# EAGLE design powerboard 3.3V, 5V_v1 (EAGLE 7.5.0)
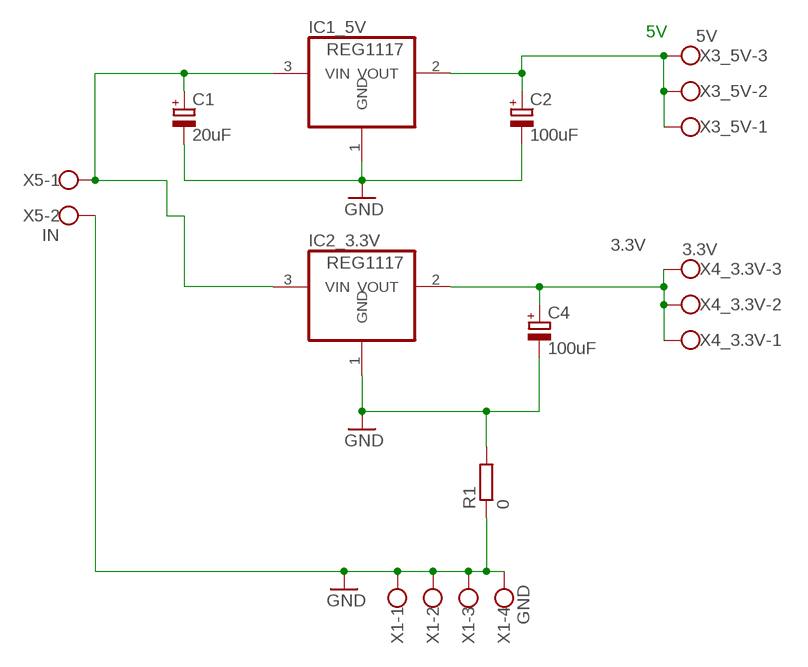
[diagram p0: schematic, sheet 1]

## Parts
C1  20uF  CPOL-EUE3.5-8  [E3,5-8]
C2  100uF  CPOL-EUE3.5-8  [E3,5-8]
C4  100uF  CPOL-EUE3.5-8  [E3,5-8]
IC1_5V  REG1117  [SOT223]
IC2_3.3V  REG1117  [SOT223]
R1  0  R-EU_0204/5  [0204/5]
X1  GND  W237-4  [W237-4]
X3_5V  5V  W237-103  [W237-103]
X4_3.3V  3.3V  W237-103  [W237-103]
X5  IN  W237-102  [W237-102]

## Nets
3.3V [power]: C4.+ IC2_3.3V.2(VOUT) X4_3.3V.1 X4_3.3V.2 X4_3.3V.3
5V [power]: C2.+ IC1_5V.2(VOUT) X3_5V.1 X3_5V.2 X3_5V.3
GND [power]: C1.- C2.- C4.- IC1_5V.1(GND) IC2_3.3V.1(GND) R1.1 R1.2 X1.1 X1.2 X1.3 X1.4 X5.2
VIN [power]: C1.+ IC1_5V.3(VIN) IC2_3.3V.3(VIN) X5.1

## Library data of the parts
C1 C2 C4 = resistor:CPOL-EU: POLARIZED CAPACITOR, European symbol
IC1_5V IC2_3.3V = burr-brown:REG1117: 800mA and 1A Low Dropout (LDO) Positive Regulator 1.8V, 2.5V, 2.85V, 3.3V, 5V, and Adj; MPN: REG1117; OC_FARNELL: 1097566; OC_NEWARK: 14P6981
R1 = resistor:R-EU_: RESISTOR, European symbol
X1 = con-wago-500:W237-4: WAGO SCREW CLAMP; OC_FARNELL: unknown; OC_NEWARK: unknown
X3_5V X4_3.3V = con-wago-500:W237-103: WAGO SCREW CLAMP; MPN: 237-103; OC_FARNELL: unknown; OC_NEWARK: 18M7116
X5 = con-wago-500:W237-102: WAGO SCREW CLAMP; MPN: 237-102; OC_FARNELL: unknown; OC_NEWARK: 70K9898

## Net classes
1 power: width 1 mm, clearance 0.205 mm to class 0, clearance 0.205 mm

## Board
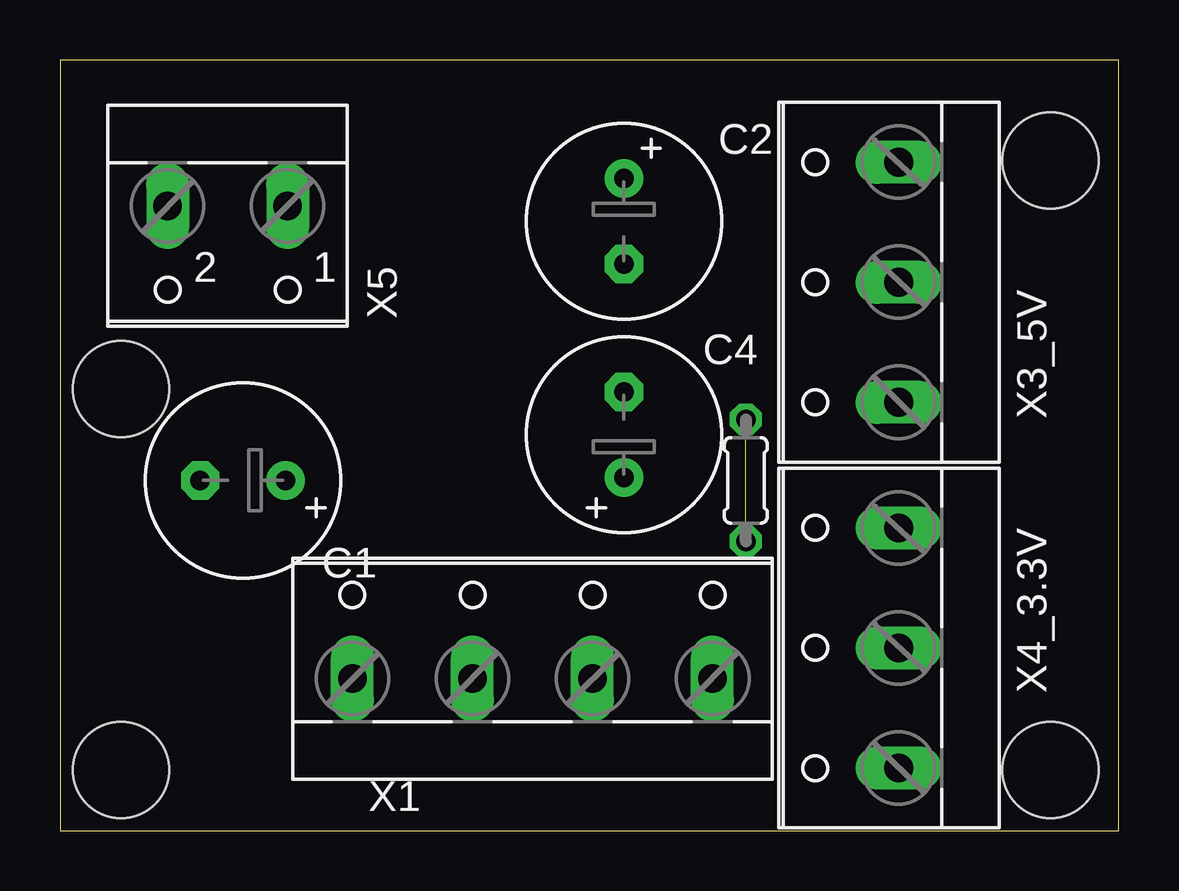
[diagram p1: board, top side]
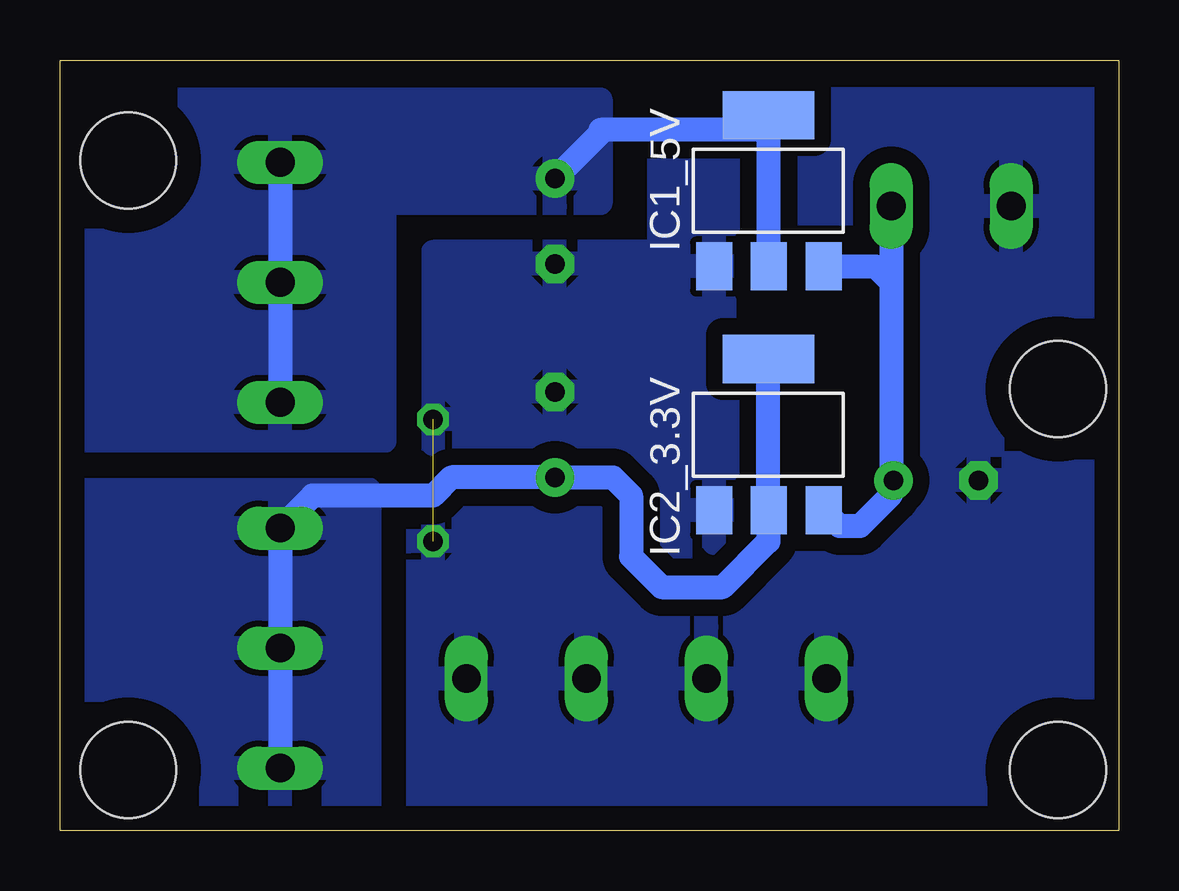
[diagram p2: board, bottom side, seen from below]

Size 44.12 x 32.12 mm. Coordinates in mm from the lower left corner, seen from the top.
Outline: 0,0 44.12,0 44.12,32.12 0,32.12 0,0
Copper layers (1*16): Top 0.035mm / dielectric 1.5mm / Bottom 0.035mm
Design rules "default *": minimum track width 10mil, minimum drill 24mil, track to track 0.7mm, track to pad 0.7mm, pad to pad 0.7mm, via to via 0.7mm, smd to smd 0.7mm, copper to edge 40mil, drill to drill 8mil, minimum pad ring 10mil, minimum via ring 8mil, stop-mask expansion 4mil, vias tented up to drill 0mil, thermal gap 10mil
Holes 4 mm at 41.27,2.54 2.54,2.54 41.27,27.94 2.54,18.41

### Footprints (pad centres in the part's own frame; a part is rotated, then mirrored left to right if it is on the bottom)
E3,5-8 = drill 0.813 pad 1.6: + -1.778,0 | drill 0.813 pad 1.6 octagon: - 1.778,0
SOT223 = smd 1.499 x 2.007: 1 -2.261,-3.15; 2 0.025,-3.15; 3 2.311,-3.15 | smd 3.81 x 2.007: 4 0,3.15
0204/5 = drill 0.813 octagon: 1 -2.54,0; 2 2.54,0
W237-4 = drill 1.194 long: 1 -7.5,-1.27; 2 -2.5,-1.27; 3 2.5,-1.27; 4 7.5,-1.27
W237-103 = drill 1.194 long: 1 -5,-1.29; 2 0,-1.29; 3 5,-1.29
W237-102 = drill 1.194 long: 1 -2.5,-1.27; 2 2.5,-1.27

### Placement (x,y rotation side)
C1  7.62,14.61 180 top
C2  23.5,25.4 270 top
C4  23.5,16.51 90 top
IC1_5V  14.61,26.67 0 bottom
IC2_3.3V  14.61,16.51 0 bottom
R1  28.57,14.61 90 top
X1  19.68,7.62 0 top
X3_5V  33.66,22.86 90 top
X4_3.3V  33.66,7.62 90 top
X5  6.99,24.77 180 top

### Tracks (layer width: path | path; a pad name or v marks a point on that pad's centre or on a via)
3.3V
  Bottom 1: X4_3.3V.1 X4_3.3V.2 X4_3.3V.3 33.59,13.97 28.57,13.97 27.81,14.73 C4.+ 21.08,14.73 20.32,13.97 20.32,11.43 19.05,10.16 16.51,10.16 14.61,12.06 14.61,13.34 | 14.61,13.34 IC2_3.3V.2 | 14.61,13.34 14.61,19.68
  pour Bottom: 43.81,14.22 31.24,14.22 31.24,0 43.81,0
5V
  Bottom 1: X3_5V.3 X3_5V.2 X3_5V.1 | IC1_5V.2 14.58,29.18 14.61,29.21 21.59,29.21 | 21.46,29.21 C2.+
  pour Bottom: 43.81,30.48 21.59,30.48 21.59,26.16 30.61,26.16 30.61,16.26 43.81,16.26
GND  (1 unrouted)
  pour Bottom: 19.18,30.48 19.18,13.34 24.77,13.34 24.77,13.97 29.21,13.97 29.21,0.64 0.64,0.64 0.64,30.48
  pour Bottom: 20.95,24.13 26.04,24.13 26.04,21.59 20.95,21.59
  pour Bottom: 18.41,24.13 28.57,24.13 28.57,10.16 18.41,10.16
VIN
  Bottom 1: X5.1 9.48,22.86 | 9.48,22.86 9.48,14.69 | 9.48,14.69 C1.+ | 9.48,14.69 9.48,14.01 10.79,12.7 11.63,12.7 IC2_3.3V.3 | IC1_5V.3 10.14,23.52 9.48,22.86